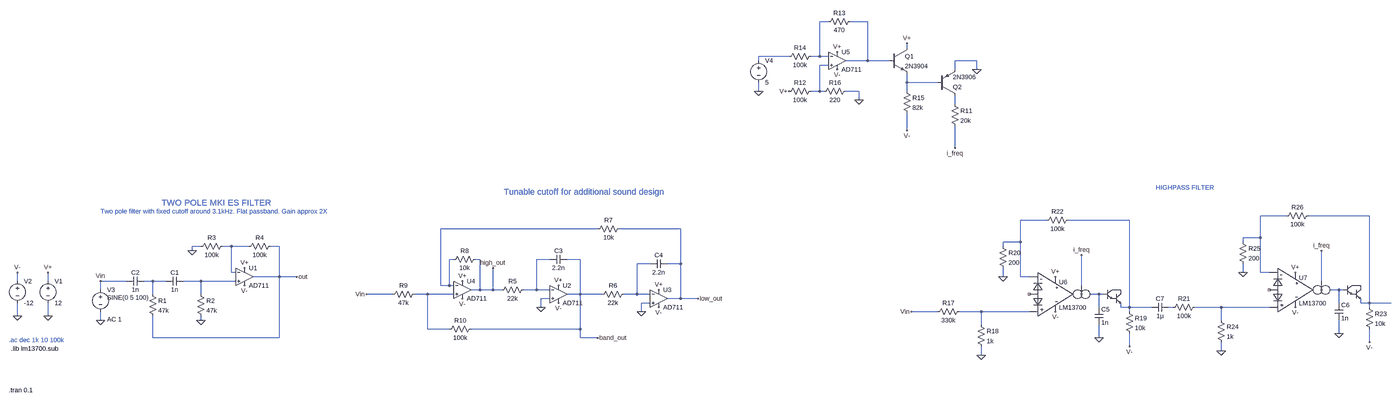
[diagram p0: schematic highpass output.asc, whole sheet]
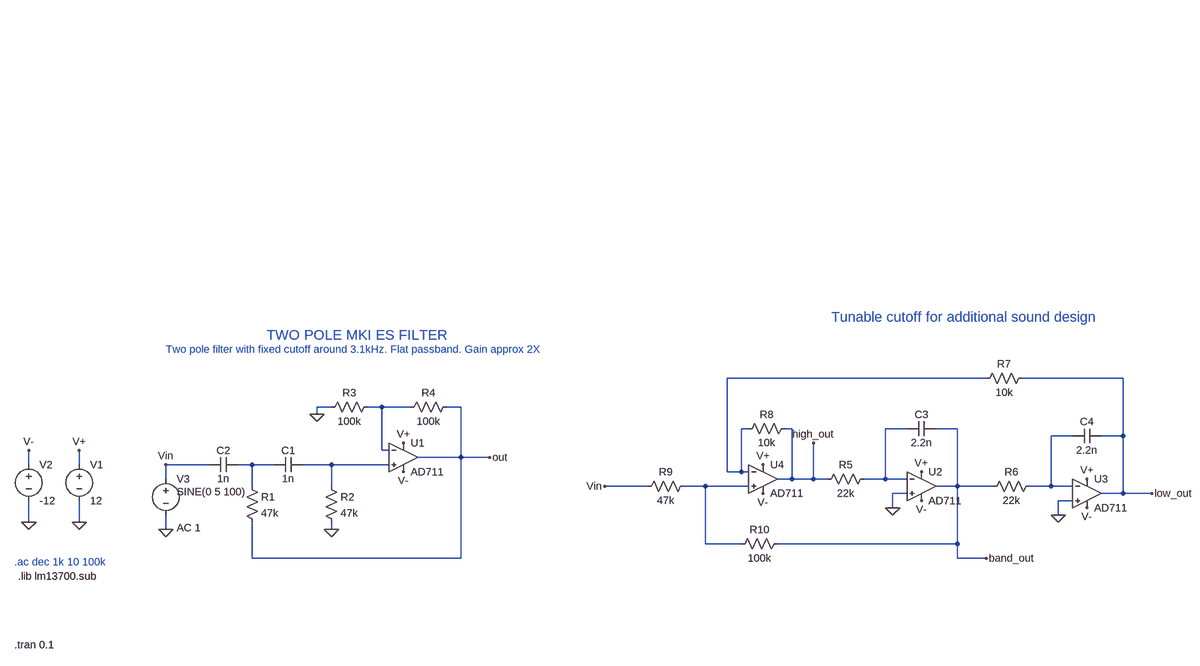
[diagram p1: schematic highpass output.asc, part, row 1 of 1, column 1 of 2]
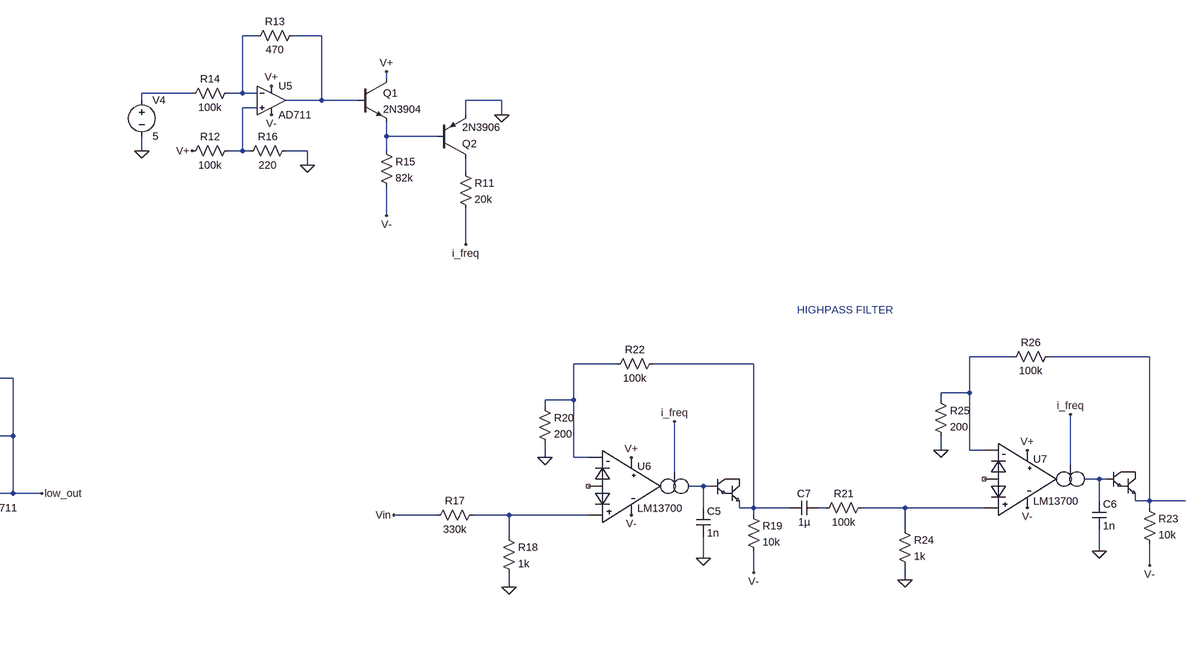
[diagram p2: schematic highpass output.asc, part, row 1 of 1, column 2 of 2]
highpass output.asc, the LTspice schematic file:
Version 4
SHEET 1 5880 680
WIRE 3104 -912 3072 -912
WIRE 3248 -912 3184 -912
WIRE 3392 -816 3392 -832
WIRE 2960 -784 2848 -784
WIRE 3072 -784 3072 -912
WIRE 3072 -784 3040 -784
WIRE 3104 -784 3072 -784
WIRE 2848 -768 2848 -784
WIRE 3248 -768 3248 -912
WIRE 3248 -768 3168 -768
WIRE 3328 -768 3248 -768
WIRE 3648 -768 3568 -768
WIRE 3104 -752 3072 -752
WIRE 3568 -736 3568 -768
WIRE 3648 -736 3648 -768
WIRE 3392 -688 3392 -720
WIRE 3504 -688 3392 -688
WIRE 2848 -656 2848 -688
WIRE 3072 -656 3072 -752
WIRE 3072 -656 3040 -656
WIRE 3088 -656 3072 -656
WIRE 3216 -656 3168 -656
WIRE 3392 -656 3392 -688
WIRE 3216 -624 3216 -656
WIRE 3568 -608 3568 -640
WIRE 3392 -512 3392 -576
WIRE 3568 -448 3568 -528
WIRE 4784 -112 4688 -112
WIRE 5088 -112 4864 -112
WIRE 3904 -96 3808 -96
WIRE 4208 -96 3984 -96
WIRE 1936 -64 1360 -64
WIRE 2240 -64 2016 -64
WIRE 4688 -32 4688 -112
WIRE 4688 -32 4624 -32
WIRE 3808 -16 3808 -96
WIRE 3808 -16 3744 -16
WIRE 4624 -16 4624 -32
WIRE 144 0 112 0
WIRE 256 0 224 0
WIRE 320 0 256 0
WIRE 432 0 400 0
WIRE 3744 0 3744 -16
WIRE 112 16 112 0
WIRE 1408 48 1392 48
WIRE 1504 48 1488 48
WIRE 1760 48 1712 48
WIRE 1872 48 1824 48
WIRE 2128 64 2080 64
WIRE 2240 64 2240 -64
WIRE 2240 64 2192 64
WIRE 256 96 256 0
WIRE 272 96 256 96
WIRE 4624 96 4624 64
WIRE 4688 96 4688 -32
WIRE 4720 96 4688 96
WIRE 432 112 432 0
WIRE 432 112 336 112
WIRE 496 112 432 112
WIRE 3744 112 3744 80
WIRE 3808 112 3808 -16
WIRE 3840 112 3808 112
WIRE -672 128 -672 96
WIRE -560 128 -560 96
WIRE -128 128 -224 128
WIRE -32 128 -64 128
WIRE 16 128 -32 128
WIRE 144 128 80 128
WIRE 272 128 144 128
WIRE 4912 128 4912 16
WIRE 1360 144 1360 -64
WIRE 1392 144 1392 48
WIRE 1392 144 1360 144
WIRE 1408 144 1392 144
WIRE 4032 144 4032 32
WIRE -224 160 -224 128
WIRE 1504 160 1504 48
WIRE 1504 160 1472 160
WIRE 1552 160 1552 80
WIRE 1552 160 1504 160
WIRE 1584 160 1552 160
WIRE 1712 160 1712 48
WIRE 1712 160 1664 160
WIRE 1760 160 1712 160
WIRE 4976 160 4944 160
WIRE 4992 160 4976 160
WIRE -32 176 -32 128
WIRE 144 176 144 128
WIRE 1184 176 1088 176
WIRE 1312 176 1264 176
WIRE 1408 176 1312 176
WIRE 1872 176 1872 48
WIRE 1872 176 1824 176
WIRE 1952 176 1872 176
WIRE 2080 176 2080 64
WIRE 2080 176 2032 176
WIRE 2128 176 2080 176
WIRE 4096 176 4064 176
WIRE 4112 176 4096 176
WIRE 1760 192 1728 192
WIRE 2240 192 2240 64
WIRE 2240 192 2192 192
WIRE 2304 192 2240 192
WIRE 2128 208 2096 208
WIRE 4976 208 4976 160
WIRE 5056 208 5056 192
WIRE 5088 208 5088 -112
WIRE 5088 208 5056 208
WIRE 5168 208 5088 208
WIRE 1728 224 1728 192
WIRE 4096 224 4096 176
WIRE 4176 224 4176 208
WIRE 4208 224 4208 -96
WIRE 4208 224 4176 224
WIRE 4288 224 4208 224
WIRE 4368 224 4352 224
WIRE 4544 224 4448 224
WIRE 4720 224 4544 224
WIRE 5088 224 5088 208
WIRE 2096 240 2096 208
WIRE 3504 240 3408 240
WIRE 3664 240 3584 240
WIRE 3840 240 3664 240
WIRE 4208 240 4208 224
WIRE -672 256 -672 208
WIRE -560 256 -560 208
WIRE -224 272 -224 240
WIRE 144 272 144 256
WIRE 4544 272 4544 224
WIRE 3664 288 3664 240
WIRE 1312 304 1312 176
WIRE 1392 304 1312 304
WIRE 1872 304 1872 176
WIRE 1872 304 1472 304
WIRE 4976 320 4976 272
WIRE -32 336 -32 256
WIRE 432 336 432 112
WIRE 432 336 -32 336
WIRE 1872 336 1872 304
WIRE 1936 336 1872 336
WIRE 4096 336 4096 288
WIRE 5088 352 5088 304
WIRE 4208 368 4208 320
WIRE 4544 384 4544 352
WIRE 3664 400 3664 368
FLAG 144 272 0
FLAG 304 80 V+
FLAG 304 144 V-
FLAG 112 16 0
FLAG 496 112 out
FLAG -560 256 0
FLAG -560 96 V+
FLAG -672 256 0
FLAG -672 96 V-
FLAG -224 272 0
FLAG 1792 144 V+
FLAG 1792 208 V-
FLAG 1728 224 0
FLAG 2160 160 V+
FLAG 2160 224 V-
FLAG 2096 240 0
FLAG 1440 192 V-
FLAG 1440 128 V+
FLAG 1936 336 band_out
FLAG 2304 192 low_out
FLAG 1088 176 Vin
FLAG -224 128 Vin
FLAG 1552 80 high_out
FLAG 3568 -448 i_freq
FLAG 3136 -800 V+
FLAG 2848 -656 0
FLAG 3216 -624 0
FLAG 2960 -656 V+
FLAG 3136 -736 V-
FLAG 3392 -512 V-
FLAG 3392 -832 V+
FLAG 3648 -736 0
FLAG 3936 112 V+
FLAG 3936 240 V-
FLAG 4032 32 i_freq
FLAG 4096 336 0
FLAG 4208 368 V-
FLAG 3408 240 Vin
FLAG 3664 400 0
FLAG 3744 112 0
FLAG 4816 96 V+
FLAG 4816 224 V-
FLAG 4912 16 i_freq
FLAG 4976 320 0
FLAG 5088 352 V-
FLAG 4544 384 0
FLAG 4624 96 0
SYMBOL res -48 160 R0
SYMATTR InstName R1
SYMATTR Value 47k
SYMBOL cap 80 112 R90
WINDOW 0 0 32 VBottom 2
WINDOW 3 32 32 VTop 2
SYMATTR InstName C1
SYMATTR Value 1n
SYMBOL res 128 160 R0
SYMATTR InstName R2
SYMATTR Value 47k
SYMBOL OpAmps\\AD711 304 48 R0
SYMATTR InstName U1
SYMBOL res 240 -16 R90
WINDOW 0 0 56 VBottom 2
WINDOW 3 32 56 VTop 2
SYMATTR InstName R3
SYMATTR Value 100k
SYMBOL res 416 -16 R90
WINDOW 0 0 56 VBottom 2
WINDOW 3 32 56 VTop 2
SYMATTR InstName R4
SYMATTR Value 100k
SYMBOL voltage -560 112 R0
WINDOW 123 0 0 Left 0
WINDOW 39 0 0 Left 0
SYMATTR InstName V1
SYMATTR Value 12
SYMBOL voltage -672 112 R0
WINDOW 123 0 0 Left 0
WINDOW 39 0 0 Left 0
SYMATTR InstName V2
SYMATTR Value -12
SYMBOL voltage -224 144 R0
WINDOW 123 24 124 Left 2
WINDOW 39 0 0 Left 0
WINDOW 3 24 44 Left 2
SYMATTR Value2 AC 1
SYMATTR Value SINE(0 5 100)
SYMATTR InstName V3
SYMBOL cap -64 112 R90
WINDOW 0 0 32 VBottom 2
WINDOW 3 32 32 VTop 2
SYMATTR InstName C2
SYMATTR Value 1n
SYMBOL OpAmps\\AD711 1792 112 R0
SYMATTR InstName U2
SYMBOL res 1680 144 R90
WINDOW 0 0 56 VBottom 2
WINDOW 3 32 56 VTop 2
SYMATTR InstName R5
SYMATTR Value 22k
SYMBOL cap 1824 32 R90
WINDOW 0 0 32 VBottom 2
WINDOW 3 32 32 VTop 2
SYMATTR InstName C3
SYMATTR Value 2.2n
SYMBOL OpAmps\\AD711 2160 128 R0
SYMATTR InstName U3
SYMBOL res 2048 160 R90
WINDOW 0 0 56 VBottom 2
WINDOW 3 32 56 VTop 2
SYMATTR InstName R6
SYMATTR Value 22k
SYMBOL cap 2192 48 R90
WINDOW 0 0 32 VBottom 2
WINDOW 3 32 32 VTop 2
SYMATTR InstName C4
SYMATTR Value 2.2n
SYMBOL OpAmps\\AD711 1440 96 R0
SYMATTR InstName U4
SYMBOL res 2032 -80 R90
WINDOW 0 0 56 VBottom 2
WINDOW 3 32 56 VTop 2
SYMATTR InstName R7
SYMATTR Value 10k
SYMBOL res 1504 32 R90
WINDOW 0 0 56 VBottom 2
WINDOW 3 32 56 VTop 2
SYMATTR InstName R8
SYMATTR Value 10k
SYMBOL res 1280 160 R90
WINDOW 0 0 56 VBottom 2
WINDOW 3 32 56 VTop 2
SYMATTR InstName R9
SYMATTR Value 47k
SYMBOL res 1488 288 R90
WINDOW 0 0 56 VBottom 2
WINDOW 3 32 56 VTop 2
SYMATTR InstName R10
SYMATTR Value 100k
SYMBOL res 3552 -624 R0
SYMATTR InstName R11
SYMATTR Value 20k
SYMBOL OpAmps\\AD711 3136 -832 R0
SYMATTR InstName U5
SYMBOL res 3056 -672 R90
WINDOW 0 0 56 VBottom 2
WINDOW 3 32 56 VTop 2
SYMATTR InstName R12
SYMATTR Value 100k
SYMBOL res 3200 -928 R90
WINDOW 0 0 56 VBottom 2
WINDOW 3 32 56 VTop 2
SYMATTR InstName R13
SYMATTR Value 470
SYMBOL res 3056 -800 R90
WINDOW 0 0 56 VBottom 2
WINDOW 3 32 56 VTop 2
SYMATTR InstName R14
SYMATTR Value 100k
SYMBOL npn 3328 -816 R0
SYMATTR InstName Q1
SYMATTR Value 2N3904
SYMBOL res 3376 -672 R0
SYMATTR InstName R15
SYMATTR Value 82k
SYMBOL pnp 3504 -640 M180
SYMATTR InstName Q2
SYMATTR Value 2N3906
SYMBOL voltage 2848 -784 R0
WINDOW 123 0 0 Left 0
WINDOW 39 0 0 Left 0
SYMATTR InstName V4
SYMATTR Value 5
SYMBOL res 3184 -672 R90
WINDOW 0 0 56 VBottom 2
WINDOW 3 32 56 VTop 2
SYMATTR InstName R16
SYMATTR Value 220
SYMBOL LM13700 3904 96 R0
SYMATTR InstName U6
SYMBOL res 3600 224 R90
WINDOW 0 0 56 VBottom 2
WINDOW 3 32 56 VTop 2
SYMATTR InstName R17
SYMATTR Value 330k
SYMBOL res 4192 224 R0
SYMATTR InstName R19
SYMATTR Value 10k
SYMBOL cap 4080 224 R0
SYMATTR InstName C5
SYMATTR Value 1n
SYMBOL res 3648 272 R0
SYMATTR InstName R18
SYMATTR Value 1k
SYMBOL res 3728 -16 R0
SYMATTR InstName R20
SYMATTR Value 200
SYMBOL res 4000 -112 R90
WINDOW 0 0 56 VBottom 2
WINDOW 3 32 56 VTop 2
SYMATTR InstName R22
SYMATTR Value 100k
SYMBOL LM13700 4784 80 R0
SYMATTR InstName U7
SYMBOL res 5072 208 R0
SYMATTR InstName R23
SYMATTR Value 10k
SYMBOL cap 4960 208 R0
SYMATTR InstName C6
SYMATTR Value 1n
SYMBOL res 4528 256 R0
SYMATTR InstName R24
SYMATTR Value 1k
SYMBOL res 4608 -32 R0
SYMATTR InstName R25
SYMATTR Value 200
SYMBOL res 4880 -128 R90
WINDOW 0 0 56 VBottom 2
WINDOW 3 32 56 VTop 2
SYMATTR InstName R26
SYMATTR Value 100k
SYMBOL cap 4352 208 R90
WINDOW 0 0 32 VBottom 2
WINDOW 3 32 32 VTop 2
SYMATTR InstName C7
SYMATTR Value 1µ
SYMBOL res 4464 208 R90
WINDOW 0 0 56 VBottom 2
WINDOW 3 32 56 VTop 2
SYMATTR InstName R21
SYMATTR Value 100k
TEXT -704 344 Left 2 ;.ac dec 1k 10 100k
TEXT 0 -160 Left 3 ;TWO POLE MKI ES FILTER
TEXT -224 -128 Left 2 ;Two pole filter with fixed cutoff around 3.1kHz. Flat passband. Gain approx 2X
TEXT 1592 -200 Left 3 ;Tunable cutoff for additional sound design
TEXT -696 376 Left 2 !.lib lm13700.sub
TEXT 4304 -216 Left 2 ;HIGHPASS FILTER
TEXT -704 560 Left 2 !.tran 0.1

The netlist it stands for:
* highpass output.asc
R1 N015 out 47k
C1 N016 N015 1n
R2 N016 0 47k
XU1 N016 N012 V+ V- out AD712  ; AD711, pins In+ In- V+ V- OUT
R3 N012 0 100k
R4 out N012 100k
V1 V+ 0 12
V2 V- 0 -12
V3 Vin 0 SINE(0 5 100) AC 1
C2 N015 Vin 1n
XU2 0 N013 V+ V- band_out AD712  ; AD711, pins In+ In- V+ V- OUT
R5 N013 high_out 22k
C3 band_out N013 2.2n
XU3 0 N014 V+ V- low_out AD712  ; AD711, pins In+ In- V+ V- OUT
R6 N014 band_out 22k
C4 low_out N014 2.2n
XU4 N018 N011 V+ V- high_out AD712  ; AD711, pins In+ In- V+ V- OUT
R7 low_out N011 10k
R8 high_out N011 10k
R9 N018 Vin 47k
R10 band_out N018 100k
R11 N006 i_freq 20k
XU5 N004 N001 V+ V- N002 AD712  ; AD711, pins In+ In- V+ V- OUT
R12 N004 V+ 100k
R13 N002 N001 470
R14 N001 N003 100k
Q1 V+ N002 N005 0 2N3904
R15 N005 V- 82k
Q2 N006 N005 0 0 2N3906
V4 N003 0 5
R16 0 N004 220
XU6 NC_01 N022 N009 i_freq N019 V+ V- N019 N010 LM13700 HALF13700  ; pins LIN INP INN IAB ? VCC VSS BIN BUF
R17 N022 Vin 330k
R19 N010 V- 10k
C5 N019 0 1n
R18 N022 0 1k
R20 N009 0 200
R22 N010 N009 100k
XU7 NC_02 N021 N007 i_freq N017 V+ V- N017 N008 LM13700 HALF13700  ; pins LIN INP INN IAB ? VCC VSS BIN BUF
R23 N008 V- 10k
C6 N017 0 1n
R24 N021 0 1k
R25 N007 0 200
R26 N008 N007 100k
C7 N020 N010 1µ
R21 N021 N020 100k
.model NPN NPN
.model PNP PNP
.lib standard.bjt
* .ac dec 1k 10 100k
* TWO POLE MKI ES FILTER
* Two pole filter with fixed cutoff around 3.1kHz. Flat passband. Gain approx 2X
* Tunable cutoff for additional sound design
.lib lm13700.sub
* HIGHPASS FILTER
.tran 0.1
.lib ADI1.lib
.backanno
.end